# Altium project Test Carrier Bd.PrjPcb (part 2 of 2)
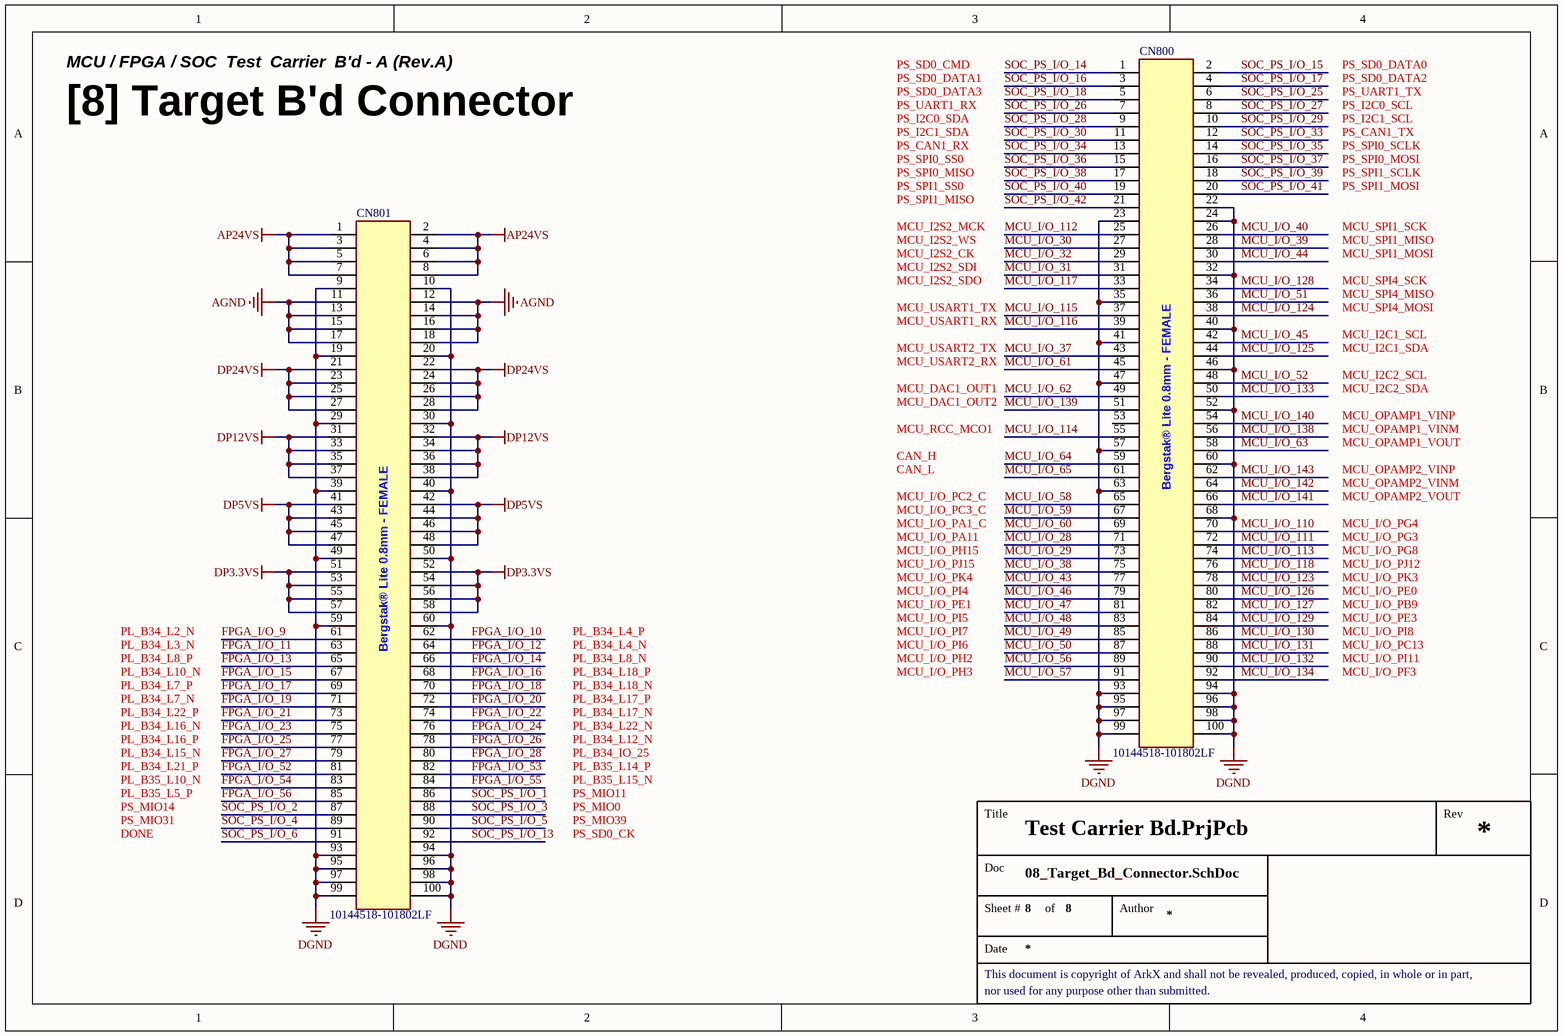
[diagram p8: 08_Target_Bd_Connector.SchDoc]

## Nets that join several sheets
AGND: 03_Power (R302.2), 08_Target_Bd_Connector (8 pins)
AP24VS: 03_Power (R301.2), 08_Target_Bd_Connector (8 pins)
DGND: 03_Power (12 pins), 04_MCU_Part (89 pins), 05_FPGA_SOC_Part1 (46 pins), 06_FPGA_SOC_Part2 (94 pins), 07_Peripheral_Part (29 pins), 08_Target_Bd_Connector (42 pins)
DP1.0VS_FPGA: 05_FPGA_SOC_Part1 (5 pins), 06_FPGA_SOC_Part2 (10 pins)
DP1.8VS_FPGA: 05_FPGA_SOC_Part1 (5 pins), 06_FPGA_SOC_Part2 (10 pins)
DP1.35VS_FPGA: 05_FPGA_SOC_Part1 (5 pins), 06_FPGA_SOC_Part2 (10 pins)
DP3.3VS: 03_Power (9 pins), 06_FPGA_SOC_Part2 (R645.1), 07_Peripheral_Part (25 pins), 08_Target_Bd_Connector (8 pins)
DP3.3VS_FPGA: 05_FPGA_SOC_Part1 (7 pins), 06_FPGA_SOC_Part2 (10 pins)
DP5VS: 03_Power (9 pins), 04_MCU_Part (5 pins), 05_FPGA_SOC_Part1 (14 pins), 06_FPGA_SOC_Part2 (11 pins), 07_Peripheral_Part (5 pins), 08_Target_Bd_Connector (8 pins)
DP12VS: 03_Power (9 pins), 08_Target_Bd_Connector (8 pins)
DP24VS: 03_Power (9 pins), 08_Target_Bd_Connector (8 pins)
BUZZER_EN: 04_MCU_Part (R429.1), 06_FPGA_SOC_Part2 (R600.1), 07_Peripheral_Part (R700.2)
FPGA_I/O_9: 06_FPGA_SOC_Part2 (CN600.63 R600.2), 08_Target_Bd_Connector (CN801.61)
FPGA_I/O_10: 06_FPGA_SOC_Part2 (CN600.65 R601.2), 08_Target_Bd_Connector (CN801.62)
FPGA_I/O_11: 06_FPGA_SOC_Part2 (CN600.69 R602.2), 08_Target_Bd_Connector (CN801.63)
FPGA_I/O_12: 06_FPGA_SOC_Part2 (CN600.71 R603.2), 08_Target_Bd_Connector (CN801.64)
FPGA_I/O_13: 06_FPGA_SOC_Part2 (CN600.75 R604.2), 08_Target_Bd_Connector (CN801.65)
FPGA_I/O_14: 06_FPGA_SOC_Part2 (CN600.77 R605.2), 08_Target_Bd_Connector (CN801.66)
FPGA_I/O_15: 06_FPGA_SOC_Part2 (CN600.81 R606.2), 08_Target_Bd_Connector (CN801.67)
FPGA_I/O_16: 06_FPGA_SOC_Part2 (CN600.83 R607.2), 08_Target_Bd_Connector (CN801.68)
FPGA_I/O_17: 06_FPGA_SOC_Part2 (CN600.87 R608.2), 08_Target_Bd_Connector (CN801.69)
FPGA_I/O_18: 06_FPGA_SOC_Part2 (CN600.89 R609.2), 08_Target_Bd_Connector (CN801.70)
FPGA_I/O_19: 06_FPGA_SOC_Part2 (CN600.93 R610.2), 08_Target_Bd_Connector (CN801.71)
FPGA_I/O_20: 06_FPGA_SOC_Part2 (CN600.95 R613.2), 08_Target_Bd_Connector (CN801.72)
FPGA_I/O_21: 06_FPGA_SOC_Part2 (CN600.99 R614.2), 08_Target_Bd_Connector (CN801.73)
FPGA_I/O_22: 06_FPGA_SOC_Part2 (CN600.101 R617.2), 08_Target_Bd_Connector (CN801.74)
FPGA_I/O_23: 06_FPGA_SOC_Part2 (CN600.105 R618.2), 08_Target_Bd_Connector (CN801.75)
FPGA_I/O_24: 06_FPGA_SOC_Part2 (CN600.107), 08_Target_Bd_Connector (CN801.76)
FPGA_I/O_25: 06_FPGA_SOC_Part2 (CN600.111), 08_Target_Bd_Connector (CN801.77)
FPGA_I/O_26: 06_FPGA_SOC_Part2 (CN600.113), 07_Peripheral_Part (CN700.2), 08_Target_Bd_Connector (CN801.78)
FPGA_I/O_27: 06_FPGA_SOC_Part2 (CN600.117), 07_Peripheral_Part (CN700.3), 08_Target_Bd_Connector (CN801.79)
FPGA_I/O_28: 06_FPGA_SOC_Part2 (CN600.119), 07_Peripheral_Part (CN700.4), 08_Target_Bd_Connector (CN801.80)
FPGA_I/O_52: 06_FPGA_SOC_Part2 (CN600.108), 07_Peripheral_Part (CN700.5), 08_Target_Bd_Connector (CN801.81)
FPGA_I/O_53: 06_FPGA_SOC_Part2 (CN600.112), 07_Peripheral_Part (CN700.6), 08_Target_Bd_Connector (CN801.82)
FPGA_I/O_54: 06_FPGA_SOC_Part2 (CN600.114), 07_Peripheral_Part (CN700.7), 08_Target_Bd_Connector (CN801.83)
FPGA_I/O_55: 06_FPGA_SOC_Part2 (CN600.118), 07_Peripheral_Part (CN700.8), 08_Target_Bd_Connector (CN801.84)
FPGA_I/O_56: 06_FPGA_SOC_Part2 (CN600.120), 07_Peripheral_Part (CN700.9), 08_Target_Bd_Connector (CN801.85)
MCU_I/O_28: 04_MCU_Part (CN400.95), 07_Peripheral_Part (CN702.3), 08_Target_Bd_Connector (CN800.71)
MCU_I/O_29: 04_MCU_Part (CN400.99), 07_Peripheral_Part (CN702.4), 08_Target_Bd_Connector (CN800.73)
MCU_I/O_30: 04_MCU_Part (CN400.101), 08_Target_Bd_Connector (CN800.27)
MCU_I/O_31: 04_MCU_Part (CN400.105), 08_Target_Bd_Connector (CN800.31)
MCU_I/O_32: 04_MCU_Part (CN400.107), 08_Target_Bd_Connector (CN800.29)
MCU_I/O_37: 04_MCU_Part (CN400.123), 07_Peripheral_Part (CN703.2), 08_Target_Bd_Connector (CN800.43)
MCU_I/O_38: 04_MCU_Part (CN400.125), 07_Peripheral_Part (CN702.5), 08_Target_Bd_Connector (CN800.75)
MCU_I/O_39: 04_MCU_Part (CN400.129 R420.2), 08_Target_Bd_Connector (CN800.28)
MCU_I/O_40: 04_MCU_Part (CN400.131 R421.2), 08_Target_Bd_Connector (CN800.26)
MCU_I/O_43: 04_MCU_Part (CN400.141), 07_Peripheral_Part (CN702.6), 08_Target_Bd_Connector (CN800.77)
MCU_I/O_44: 04_MCU_Part (CN400.143 R424.2), 08_Target_Bd_Connector (CN800.30)
MCU_I/O_45: 04_MCU_Part (CN400.147), 08_Target_Bd_Connector (CN800.42)
MCU_I/O_46: 04_MCU_Part (CN400.149), 07_Peripheral_Part (CN702.7), 08_Target_Bd_Connector (CN800.79)
MCU_I/O_47: 04_MCU_Part (CN400.153), 08_Target_Bd_Connector (CN800.81)
MCU_I/O_48: 04_MCU_Part (CN400.155), 08_Target_Bd_Connector (CN800.83)
MCU_I/O_49: 04_MCU_Part (CN400.159), 08_Target_Bd_Connector (CN800.85)
MCU_I/O_50: 04_MCU_Part (CN400.161), 08_Target_Bd_Connector (CN800.87)
MCU_I/O_51: 04_MCU_Part (CN400.165), 07_Peripheral_Part (CN703.8), 08_Target_Bd_Connector (CN800.36)
MCU_I/O_52: 04_MCU_Part (CN400.167), 07_Peripheral_Part (CN703.4), 08_Target_Bd_Connector (CN800.48)
MCU_I/O_56: 04_MCU_Part (CN400.179), 08_Target_Bd_Connector (CN800.89)
MCU_I/O_57: 04_MCU_Part (CN400.183), 08_Target_Bd_Connector (CN800.91)
MCU_I/O_58: 04_MCU_Part (CN400.185), 08_Target_Bd_Connector (CN800.65)
MCU_I/O_59: 04_MCU_Part (CN400.189), 08_Target_Bd_Connector (CN800.67)
MCU_I/O_60: 04_MCU_Part (CN400.191), 07_Peripheral_Part (CN702.2), 08_Target_Bd_Connector (CN800.69)
MCU_I/O_61: 04_MCU_Part (CN400.195), 07_Peripheral_Part (CN703.3), 08_Target_Bd_Connector (CN800.45)
MCU_I/O_62: 04_MCU_Part (CN400.197), 07_Peripheral_Part (CN703.9), 08_Target_Bd_Connector (CN800.49)
MCU_I/O_63: 04_MCU_Part (CN400.201), 08_Target_Bd_Connector (CN800.58)
MCU_I/O_64: 04_MCU_Part (CN400.203), 07_Peripheral_Part (CN702.8), 08_Target_Bd_Connector (CN800.59)
MCU_I/O_65: 04_MCU_Part (CN400.207), 07_Peripheral_Part (CN702.9), 08_Target_Bd_Connector (CN800.61)
MCU_I/O_110: 04_MCU_Part (CN400.96), 08_Target_Bd_Connector (CN800.70)
MCU_I/O_111: 04_MCU_Part (CN400.100), 08_Target_Bd_Connector (CN800.72)
MCU_I/O_112: 04_MCU_Part (CN400.102), 08_Target_Bd_Connector (CN800.25)
MCU_I/O_113: 04_MCU_Part (CN400.106), 08_Target_Bd_Connector (CN800.74)
MCU_I/O_114: 04_MCU_Part (CN400.108), 08_Target_Bd_Connector (CN800.55)
MCU_I/O_115: 04_MCU_Part (CN400.112), 08_Target_Bd_Connector (CN800.37)
MCU_I/O_116: 04_MCU_Part (CN400.114), 08_Target_Bd_Connector (CN800.39)
MCU_I/O_117: 04_MCU_Part (CN400.118), 08_Target_Bd_Connector (CN800.33)
MCU_I/O_118: 04_MCU_Part (CN400.120), 08_Target_Bd_Connector (CN800.76)
MCU_I/O_123: 04_MCU_Part (CN400.136), 08_Target_Bd_Connector (CN800.78)
MCU_I/O_124: 04_MCU_Part (CN400.138), 07_Peripheral_Part (CN703.7), 08_Target_Bd_Connector (CN800.38)
MCU_I/O_125: 04_MCU_Part (CN400.142), 08_Target_Bd_Connector (CN800.44)
MCU_I/O_126: 04_MCU_Part (CN400.144), 08_Target_Bd_Connector (CN800.80)
MCU_I/O_127: 04_MCU_Part (CN400.148), 08_Target_Bd_Connector (CN800.82)
MCU_I/O_128: 04_MCU_Part (CN400.150), 07_Peripheral_Part (CN703.6), 08_Target_Bd_Connector (CN800.34)
MCU_I/O_129: 04_MCU_Part (CN400.154), 08_Target_Bd_Connector (CN800.84)
MCU_I/O_130: 04_MCU_Part (CN400.156), 08_Target_Bd_Connector (CN800.86)
MCU_I/O_131: 04_MCU_Part (CN400.160), 08_Target_Bd_Connector (CN800.88)
MCU_I/O_132: 04_MCU_Part (CN400.162), 08_Target_Bd_Connector (CN800.90)
MCU_I/O_133: 04_MCU_Part (CN400.166), 07_Peripheral_Part (CN703.5), 08_Target_Bd_Connector (CN800.50)
MCU_I/O_134: 04_MCU_Part (CN400.168), 08_Target_Bd_Connector (CN800.92)
MCU_I/O_138: 04_MCU_Part (CN400.180), 08_Target_Bd_Connector (CN800.56)
MCU_I/O_139: 04_MCU_Part (CN400.184), 08_Target_Bd_Connector (CN800.51)
MCU_I/O_140: 04_MCU_Part (CN400.186), 08_Target_Bd_Connector (CN800.54)
MCU_I/O_141: 04_MCU_Part (CN400.190), 08_Target_Bd_Connector (CN800.66)
MCU_I/O_142: 04_MCU_Part (CN400.192), 08_Target_Bd_Connector (CN800.64)
MCU_I/O_143: 04_MCU_Part (CN400.196), 08_Target_Bd_Connector (CN800.62)
PG_1.35V: 05_FPGA_SOC_Part1 (5 pins), 06_FPGA_SOC_Part2 (R643.1)
PG_3.3V: 05_FPGA_SOC_Part1 (5 pins), 06_FPGA_SOC_Part2 (R644.1)
SOC_PS_I/O_1: 06_FPGA_SOC_Part2 (CN600.167 R621.2), 08_Target_Bd_Connector (CN801.86)
SOC_PS_I/O_2: 06_FPGA_SOC_Part2 (CN600.169 R622.2), 08_Target_Bd_Connector (CN801.87)
SOC_PS_I/O_3: 06_FPGA_SOC_Part2 (CN600.173 R624.2), 08_Target_Bd_Connector (CN801.88)
SOC_PS_I/O_4: 06_FPGA_SOC_Part2 (CN600.175 R625.2), 08_Target_Bd_Connector (CN801.89)
SOC_PS_I/O_5: 06_FPGA_SOC_Part2 (CN600.179 R627.2), 08_Target_Bd_Connector (CN801.90)
SOC_PS_I/O_6: 06_FPGA_SOC_Part2 (CN600.181), 08_Target_Bd_Connector (CN801.91)
SOC_PS_I/O_13: 06_FPGA_SOC_Part2 (CN600.203 R628.2), 08_Target_Bd_Connector (CN801.92)
SOC_PS_I/O_14: 06_FPGA_SOC_Part2 (CN600.205 R629.2), 08_Target_Bd_Connector (CN800.1)
SOC_PS_I/O_15: 06_FPGA_SOC_Part2 (CN600.209 R630.2), 08_Target_Bd_Connector (CN800.2)
SOC_PS_I/O_16: 06_FPGA_SOC_Part2 (CN600.211 R631.2), 08_Target_Bd_Connector (CN800.3)
SOC_PS_I/O_17: 06_FPGA_SOC_Part2 (CN600.215 R632.2), 08_Target_Bd_Connector (CN800.4)
SOC_PS_I/O_18: 06_FPGA_SOC_Part2 (CN600.217 R633.2), 08_Target_Bd_Connector (CN800.5)
SOC_PS_I/O_21: 05_FPGA_SOC_Part1 (R511.1), 06_FPGA_SOC_Part2 (CN600.227 R615.1)
SOC_PS_I/O_22: 05_FPGA_SOC_Part1 (R512.1), 06_FPGA_SOC_Part2 (CN600.229 R619.1)
SOC_PS_I/O_23: 05_FPGA_SOC_Part1 (R513.1), 06_FPGA_SOC_Part2 (CN600.233 R611.1)
SOC_PS_I/O_24: 05_FPGA_SOC_Part1 (R514.1), 06_FPGA_SOC_Part2 (CN600.235 R623.1)
SOC_PS_I/O_25: 06_FPGA_SOC_Part2 (CN600.168 R634.2), 07_Peripheral_Part (CN701.2), 08_Target_Bd_Connector (CN800.6)
SOC_PS_I/O_26: 06_FPGA_SOC_Part2 (CN600.170 R635.2), 07_Peripheral_Part (CN701.3), 08_Target_Bd_Connector (CN800.7)
SOC_PS_I/O_27: 06_FPGA_SOC_Part2 (CN600.174), 07_Peripheral_Part (CN701.4), 08_Target_Bd_Connector (CN800.8)
SOC_PS_I/O_28: 06_FPGA_SOC_Part2 (CN600.176), 07_Peripheral_Part (CN701.5), 08_Target_Bd_Connector (CN800.9)
SOC_PS_I/O_29: 06_FPGA_SOC_Part2 (CN600.180 R636.2), 08_Target_Bd_Connector (CN800.10)
SOC_PS_I/O_30: 06_FPGA_SOC_Part2 (CN600.182 R637.2), 08_Target_Bd_Connector (CN800.11)
SOC_PS_I/O_33: 06_FPGA_SOC_Part2 (CN600.192), 08_Target_Bd_Connector (CN800.12)
SOC_PS_I/O_34: 06_FPGA_SOC_Part2 (CN600.194), 08_Target_Bd_Connector (CN800.13)
SOC_PS_I/O_35: 06_FPGA_SOC_Part2 (CN600.198), 07_Peripheral_Part (CN701.6), 08_Target_Bd_Connector (CN800.14)
SOC_PS_I/O_36: 06_FPGA_SOC_Part2 (CN600.200 R638.2), 07_Peripheral_Part (CN701.9), 08_Target_Bd_Connector (CN800.15)
SOC_PS_I/O_37: 06_FPGA_SOC_Part2 (CN600.204), 07_Peripheral_Part (CN701.7), 08_Target_Bd_Connector (CN800.16)
SOC_PS_I/O_38: 06_FPGA_SOC_Part2 (CN600.206), 07_Peripheral_Part (CN701.8), 08_Target_Bd_Connector (CN800.17)
SOC_PS_I/O_39: 06_FPGA_SOC_Part2 (CN600.210 R639.2), 08_Target_Bd_Connector (CN800.18)
SOC_PS_I/O_40: 06_FPGA_SOC_Part2 (CN600.212 R640.2), 08_Target_Bd_Connector (CN800.19)
SOC_PS_I/O_41: 06_FPGA_SOC_Part2 (CN600.216 R641.2), 08_Target_Bd_Connector (CN800.20)
SOC_PS_I/O_42: 06_FPGA_SOC_Part2 (CN600.218 R642.2), 08_Target_Bd_Connector (CN800.21)
SOC_PS_I/O_48: 05_FPGA_SOC_Part1 (C504.2 R501.1 R515.1 SW500.1), 06_FPGA_SOC_Part2 (CN600.236)
TFT_LCD_DATA0: 04_MCU_Part (R400.1), 06_FPGA_SOC_Part2 (R627.1), 07_Peripheral_Part (TFT700.10)
TFT_LCD_DATA1: 04_MCU_Part (R401.1), 06_FPGA_SOC_Part2 (R628.1), 07_Peripheral_Part (TFT700.11)
TFT_LCD_DATA2: 04_MCU_Part (R402.1), 06_FPGA_SOC_Part2 (R629.1), 07_Peripheral_Part (TFT700.12)
TFT_LCD_DATA3: 04_MCU_Part (R403.1), 06_FPGA_SOC_Part2 (R630.1), 07_Peripheral_Part (TFT700.13)
TFT_LCD_DATA4: 04_MCU_Part (R404.1), 06_FPGA_SOC_Part2 (R631.1), 07_Peripheral_Part (TFT700.14)
TFT_LCD_DATA5: 04_MCU_Part (R405.1), 06_FPGA_SOC_Part2 (R632.1), 07_Peripheral_Part (TFT700.15)
TFT_LCD_DATA6: 04_MCU_Part (R406.1), 06_FPGA_SOC_Part2 (R633.1), 07_Peripheral_Part (TFT700.16)
TFT_LCD_DATA7: 04_MCU_Part (R407.1), 06_FPGA_SOC_Part2 (R634.1), 07_Peripheral_Part (TFT700.17)
TFT_LCD_DATA8: 04_MCU_Part (R408.1), 06_FPGA_SOC_Part2 (R635.1), 07_Peripheral_Part (TFT700.18)
TFT_LCD_DATA9: 04_MCU_Part (R409.1), 06_FPGA_SOC_Part2 (R636.1), 07_Peripheral_Part (TFT700.19)
TFT_LCD_DATA10: 04_MCU_Part (R410.1), 06_FPGA_SOC_Part2 (R637.1), 07_Peripheral_Part (TFT700.20)
TFT_LCD_DATA11: 04_MCU_Part (R411.1), 06_FPGA_SOC_Part2 (R638.1), 07_Peripheral_Part (TFT700.21)
TFT_LCD_DATA12: 04_MCU_Part (R412.1), 06_FPGA_SOC_Part2 (R639.1), 07_Peripheral_Part (TFT700.22)
TFT_LCD_DATA13: 04_MCU_Part (R413.1), 06_FPGA_SOC_Part2 (R640.1), 07_Peripheral_Part (TFT700.23)
TFT_LCD_DATA14: 04_MCU_Part (R414.1), 06_FPGA_SOC_Part2 (R641.1), 07_Peripheral_Part (TFT700.24)
TFT_LCD_DATA15: 04_MCU_Part (R415.1), 06_FPGA_SOC_Part2 (R642.1), 07_Peripheral_Part (TFT700.25)
TFT_LCD_nCS: 04_MCU_Part (R426.1), 06_FPGA_SOC_Part2 (R622.1), 07_Peripheral_Part (TFT700.5)
TFT_LCD_nRST: 04_MCU_Part (R425.1), 06_FPGA_SOC_Part2 (R621.1), 07_Peripheral_Part (TFT700.4)
TFT_LCD_nWR: 04_MCU_Part (R428.1), 06_FPGA_SOC_Part2 (R625.1), 07_Peripheral_Part (TFT700.7)
TFT_LCD_RS: 04_MCU_Part (R427.1), 06_FPGA_SOC_Part2 (R624.1), 07_Peripheral_Part (TFT700.6)
TFT_LCD_TS_nCS: 04_MCU_Part (R423.1), 07_Peripheral_Part (TFT700.34)
TFT_LCD_TS_nINT: 04_MCU_Part (R422.1), 07_Peripheral_Part (TFT700.38)
TFT_LCD_TS_SPI_MISO: 04_MCU_Part (R420.1), 07_Peripheral_Part (TFT700.36)
TFT_LCD_TS_SPI_MOSI: 04_MCU_Part (R424.1), 07_Peripheral_Part (TFT700.35)
TFT_LCD_TS_SPI_SCK: 04_MCU_Part (R421.1), 07_Peripheral_Part (TFT700.37)
USER_DIP_SW1: 04_MCU_Part (R416.1), 06_FPGA_SOC_Part2 (R613.1), 07_Peripheral_Part (C712.2 R712.2 SW704.1)
USER_DIP_SW2: 04_MCU_Part (R417.1), 06_FPGA_SOC_Part2 (R614.1), 07_Peripheral_Part (C713.2 R713.2 SW704.2)
USER_DIP_SW3: 04_MCU_Part (R418.1), 06_FPGA_SOC_Part2 (R617.1), 07_Peripheral_Part (C714.2 R714.2 SW704.3)
USER_DIP_SW4: 04_MCU_Part (R419.1), 06_FPGA_SOC_Part2 (R618.1), 07_Peripheral_Part (C715.2 R715.2 SW704.4)
USER_LED1_BLUE: 04_MCU_Part (R434.1), 06_FPGA_SOC_Part2 (R601.1), 07_Peripheral_Part (R702.2)
USER_LED1_GREEN: 04_MCU_Part (R435.1), 06_FPGA_SOC_Part2 (R602.1), 07_Peripheral_Part (R707.2)
USER_LED1_RED: 04_MCU_Part (R436.1), 06_FPGA_SOC_Part2 (R603.1), 07_Peripheral_Part (R708.2)
USER_LED2_BLUE: 04_MCU_Part (R437.1), 06_FPGA_SOC_Part2 (R604.1), 07_Peripheral_Part (R709.2)
USER_LED2_GREEN: 04_MCU_Part (R438.1), 06_FPGA_SOC_Part2 (R605.1), 07_Peripheral_Part (R710.2)
USER_LED2_RED: 04_MCU_Part (R439.1), 06_FPGA_SOC_Part2 (R606.1), 07_Peripheral_Part (R711.2)
USER_TACT_SW1: 06_FPGA_SOC_Part2 (R607.1), 07_Peripheral_Part (C708.2 R703.1 SW700.1)
USER_TACT_SW2: 06_FPGA_SOC_Part2 (R608.1), 07_Peripheral_Part (C709.2 R704.1 SW701.1)
USER_TACT_SW3: 06_FPGA_SOC_Part2 (R609.1), 07_Peripheral_Part (C710.2 R705.1 SW702.1)
USER_TACT_SW4: 06_FPGA_SOC_Part2 (R610.1), 07_Peripheral_Part (C711.2 R706.1 SW703.1)